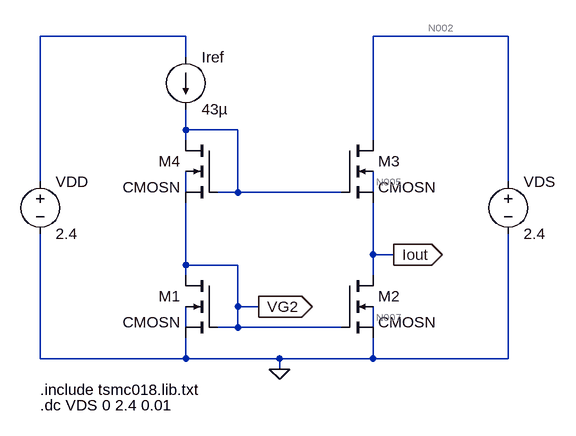
[diagram p0: schematic cascode current mirror.asc]
cascode current mirror.asc, the LTspice schematic file:
Version 4
SHEET 1 880 680
WIRE 80 0 -144 0
WIRE 576 0 368 0
WIRE 80 32 80 0
WIRE 80 144 80 112
WIRE 160 144 80 144
WIRE 80 160 80 144
WIRE 368 160 368 0
WIRE -144 224 -144 0
WIRE 576 224 576 0
WIRE 80 240 80 208
WIRE 160 240 160 144
WIRE 160 240 128 240
WIRE 320 240 160 240
WIRE 368 240 368 208
WIRE 368 336 368 256
WIRE 400 336 368 336
WIRE 80 352 80 256
WIRE 160 352 80 352
WIRE 80 368 80 352
WIRE 368 368 368 336
WIRE 160 416 160 352
WIRE 192 416 160 416
WIRE 80 448 80 416
WIRE 160 448 160 416
WIRE 160 448 128 448
WIRE 320 448 160 448
WIRE 368 448 368 416
WIRE -144 496 -144 304
WIRE 80 496 80 464
WIRE 80 496 -144 496
WIRE 224 496 80 496
WIRE 368 496 368 464
WIRE 368 496 224 496
WIRE 576 496 576 304
WIRE 576 496 368 496
WIRE 224 512 224 496
FLAG 400 336 Iout
IOPIN 400 336 Out
FLAG 192 416 VG2
IOPIN 192 416 Out
FLAG 224 512 0
SYMBOL current 80 32 R0
SYMATTR InstName Iref
SYMATTR Value 43µ
SYMBOL voltage -144 208 R0
WINDOW 123 0 0 Left 0
WINDOW 39 0 0 Left 0
SYMATTR InstName VDD
SYMATTR Value 2.4
SYMBOL voltage 576 208 R0
WINDOW 123 0 0 Left 0
WINDOW 39 0 0 Left 0
SYMATTR InstName VDS
SYMATTR Value 2.4
SYMBOL nmos4 320 160 R0
SYMATTR InstName M3
SYMATTR Value CMOSN
SYMATTR Value2 l=50m w=50m
SYMBOL nmos4 320 368 R0
SYMATTR InstName M2
SYMATTR Value CMOSN
SYMATTR Value2 l=50m w=50m
SYMBOL nmos4 128 160 M0
SYMATTR InstName M4
SYMATTR Value CMOSN
SYMATTR Value2 l=50m w=50m
SYMBOL nmos4 128 368 M0
SYMATTR InstName M1
SYMATTR Value CMOSN
SYMATTR Value2 l=50m w=50m
TEXT -144 544 Left 2 !.include tsmc018.lib.txt
TEXT -144 568 Left 2 !.dc VDS 0 2.4 0.01

The netlist it stands for:
* cascode current mirror.asc
Iref N001 N003 43µ
VDD N001 0 2.4
VDS N002 0 2.4
M3 N002 N003 Iout N005 CMOSN l=50m w=50m
M2 Iout VG2 0 N007 CMOSN l=50m w=50m
M4 N003 N003 VG2 N004 CMOSN l=50m w=50m
M1 VG2 VG2 0 N006 CMOSN l=50m w=50m
.model NMOS NMOS
.model PMOS PMOS
.lib standard.mos
.include tsmc018.lib.txt
.dc VDS 0 2.4 0.01
.backanno
.end

* Results of the author's LTspice run, read from the files saved beside the schematic
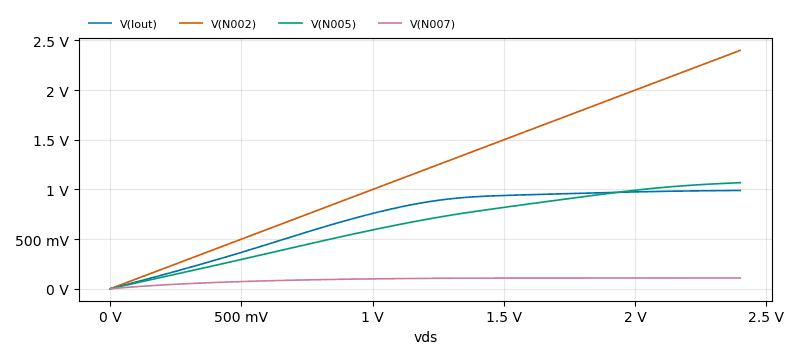
[diagram p1: DC transfer characteristic of cascode current mirror.asc, plotted from the saved traces]
* DC transfer characteristic, 1 run:
*   V(Iout): 0.007901 fV at vds=0 V, 990.2 mV at vds=2.4 V, min 0.007901 fV, max 990.2 mV
*   V(N002): 0 V at vds=0 V, 2.4 V at vds=2.4 V, min 0 V, max 2.4 V
*   V(N005): 2.141 pV at vds=0 V, 1.068 V at vds=2.4 V, min 2.141 pV, max 1.068 V
*   V(N007): 0.003114 fV at vds=0 V, 109.2 mV at vds=2.4 V, min 0.003114 fV, max 109.2 mV